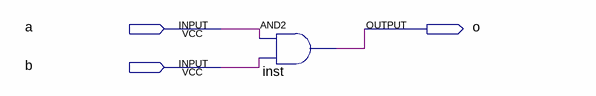
[diagram p0: schematic sheet]
// Quartus schematic test_add.bdf as structural Verilog: 1 symbols, 3 pins
module test_add (
  input  a,
  input  b,
  output o
);

  and inst (o, a, b);
endmodule
